# Altium schematic sheet ovencontrol.SchDoc
size A3; PageSetup: Record=PageOptions|CenterHorizontal=True|CenterVertical=True|PrintScale=1.00|XCorrection=1.00|YCorrection=1.00|PrintKind=1|BorderSize=5000000|LeftOffset=0|BottomOffset=0|Orientation=2|PaperLength=1000|PaperWidth=1000|Scale=100|PaperSource=7|PrintQuality=-4|MediaType=1|DitherType=10|PaperKind=A3|PrintScaleMode=1
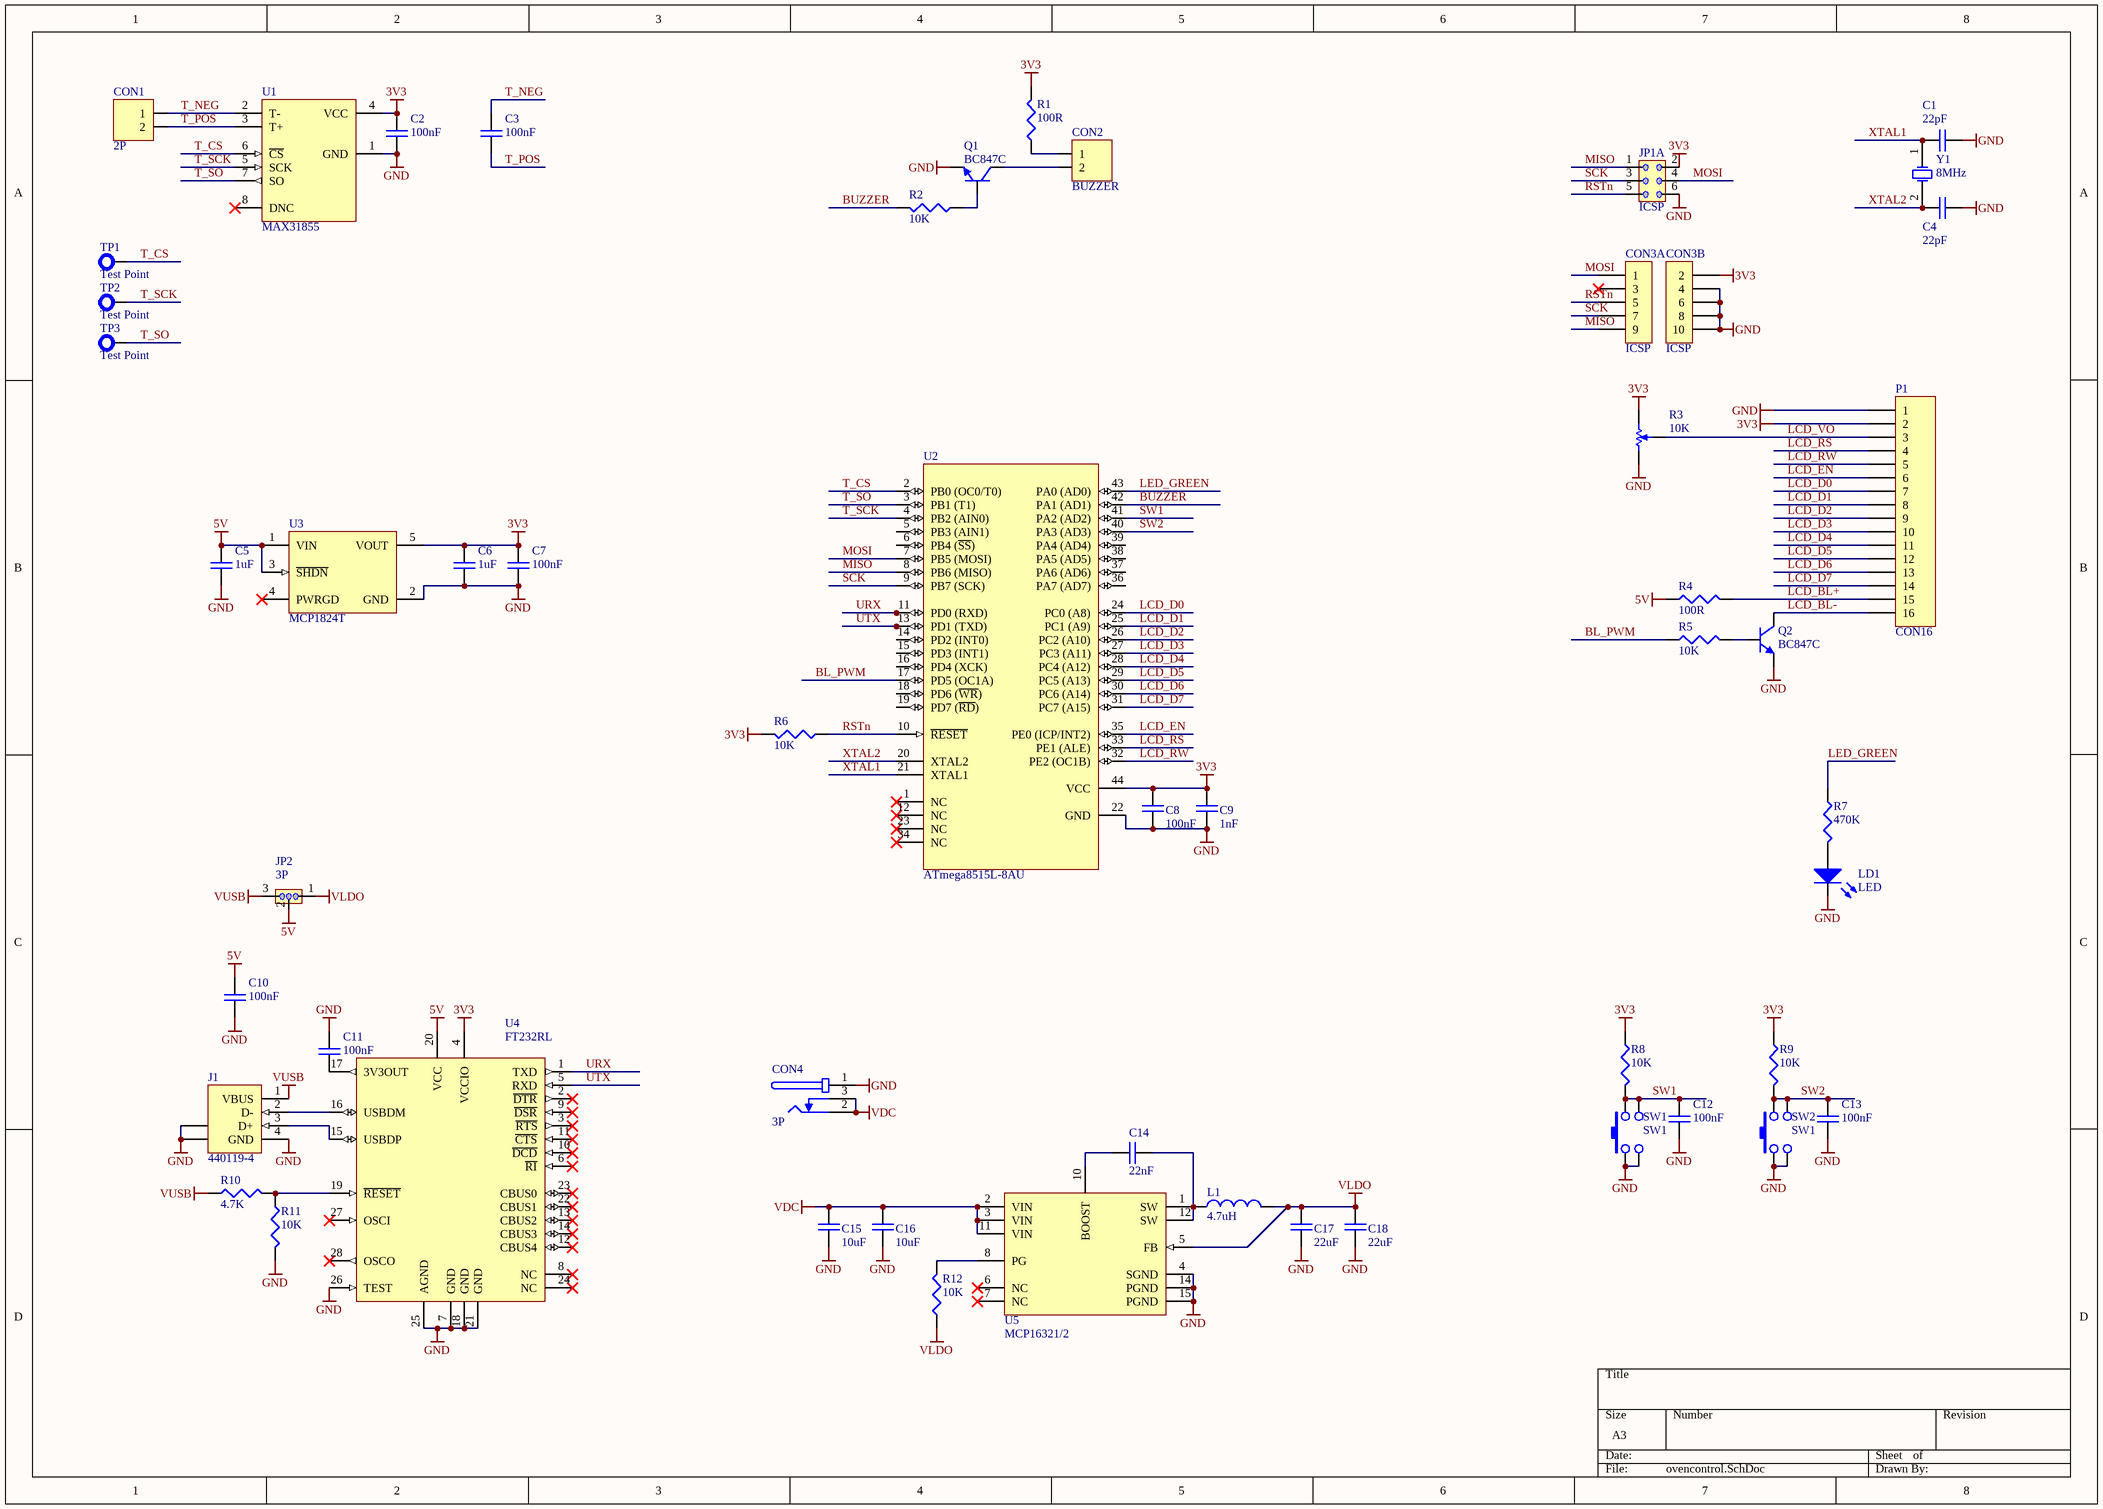
[diagram p0: ovencontrol.SchDoc]

## Parts
C1  22pF  [0603]
C2  100nF  [0603]
C3  100nF  [0603]
C4  22pF  [0603]
C5  1uF  [0603]
C6  1uF  [0603]
C7  100nF  [0603]
C8  100nF  [0603]
C9  1nF  [0603]
C10  100nF  [0603]
C11  100nF  [0603]
C12  100nF  [0603]
C13  100nF  [0603]
C14  22nF  [0603]
C15  10uF  [0603]
C16  10uF  [0603]
C17  22uF  [0603]
C18  22uF  [0603]
CON1  2P  [INTERLOCK2-5MM]
CON2  BUZZER  [SIP-2]
CON3  ICSP  [IDC-10-F]  (parts A,B of 2)
CON4  3P  [JACKPOW/PD-2.5MM-TH]
J1  440119-4  [440119]
JP1  ICSP  [DIL-6]  (part A of 3)
JP2  3P  [SIP-3]
L1  4.7uH  [6X6]
LD1  LED  [0805@DIODE]
P1  CON16  [HDR1X16]
Q1  BC847C  [SOT-23@BEC]
Q2  BC847C  [SOT-23@BEC]
R1  100R  [0603]
R2  10K  [0603]
R3  10K  [POT4MM-2]
R4  100R  [0603]
R5  10K  [0603]
R6  10K  [0603]
R7  470K  [0603]
R8  10K  [0603]
R9  10K  [0603]
R10  4.7K  [0603]
R11  10K  [0603]
R12  10K  [0603]
SW1  SW1  [MICROSWITCH]
SW2  SW1  [MICROSWITCH]
TP1  Test Point  [TERMINAL]  (no BOM)
TP2  Test Point  [TERMINAL]  (no BOM)
TP3  Test Point  [TERMINAL]  (no BOM)
U1  MAX31855  [SOIC-8]
U2  ATmega8515L-8AU  [TQFP-44]
U3  MCP1824T  [SOT-23-5]
U4  FT232RL  [SSOP-28]
U5  MCP16321/2  [QFN50P300X300-16V4L]
Y1  8MHz  [HC-49U]

## Nets
3V3: C2.1 C6.1 C7.1 C8.2 C9.2 CON3.2 JP1.2 P1.2 R1.2 R3.CW(+) R6.1 R8.1 R9.1 U1.4(VCC) U2.44(VCC) U3.5(VOUT) U4.4(VCCIO)
5V: C5.1 C10.1 JP2.2 R4.1 U3.1(VIN) U3.3(~{SHDN}) U4.20(VCC)
GND: C1.1 C2.2 C4.1 C5.2 C6.2 C7.2 C8.1 C9.1 C10.2 C11.1 C12.2 C13.2 C15.2 C16.2 C17.2 C18.2 CON3.4 CON3.6 CON3.8 CON3.10 CON4.1 J1.4(GND) J1.5(SHLD) J1.6(SHLD) JP1.6 LD1.K P1.1 Q1.E Q2.E R3.CCW(-) R11.2 SW1.1 SW1.3 SW2.1 SW2.3 U1.1(GND) U2.22(GND) U3.2(GND) U4.7(GND) U4.18(GND) U4.21(GND) U4.25(AGND) U4.26(TEST) U5.4(SGND) U5.14(PGND) U5.15(PGND)
VDC: C15.1 C16.1 CON4.2 CON4.3 U5.2(VIN) U5.3(VIN) U5.11(VIN)
VLDO: C17.1 C18.1 JP2.1 L1.2 R12.2 U5.5(FB)
VUSB: J1.1(VBUS) JP2.3 R10.1
BL_PWM: R5.1 U2.17(PD5_(OC1A))
BUZZER: R2.2 U2.42(PA1_(AD1))
LCD_BL+: P1.15 R4.2
LCD_BL-: P1.16 Q2.C
LCD_D0: P1.7 U2.24(PC0_(A8))
LCD_D1: P1.8 U2.25(PC1_(A9))
LCD_D2: P1.9 U2.26(PC2_(A10))
LCD_D3: P1.10 U2.27(PC3_(A11))
LCD_D4: P1.11 U2.28(PC4_(A12))
LCD_D5: P1.12 U2.29(PC5_(A13))
LCD_D6: P1.13 U2.30(PC6_(A14))
LCD_D7: P1.14 U2.31(PC7_(A15))
LCD_EN: P1.6 U2.35(PE0_(ICP/INT2))
LCD_RS: P1.4 U2.33(PE1_(ALE))
LCD_RW: P1.5 U2.32(PE2_(OC1B))
LCD_VO: P1.3 R3.W
LED_GREEN: R7.1 U2.43(PA0_(AD0))
MISO: CON3.9 JP1.1 U2.8(PB6_(MISO))
MOSI: CON3.1 JP1.4 U2.7(PB5_(MOSI))
RSTn: CON3.5 JP1.5 R6.2 U2.10(~{RESET})
SCK: CON3.7 JP1.3 U2.9(PB7_(SCK))
SW1: C12.1 R8.2 SW1.2 SW1.4 U2.41(PA2_(AD2))
SW2: C13.1 R9.2 SW2.2 SW2.4 U2.40(PA3_(AD3))
T_CS: TP1.1(TP) U1.6(~{CS}) U2.2(PB0_(OC0/T0))
T_NEG: C3.1 CON1.1 U1.2(T-)
T_POS: C3.2 CON1.2 U1.3(T+)
T_SCK: TP2.1(TP) U1.5(SCK) U2.4(PB2_(AIN0))
T_SO: TP3.1(TP) U1.7(SO) U2.3(PB1_(T1))
URX: U2.11(PD0_(RXD)) U4.1(TXD)
UTX: U2.13(PD1_(TXD)) U4.5(RXD)
XTAL1: C1.2 U2.21(XTAL1) Y1.1(OSC1)
XTAL2: C4.2 U2.20(XTAL2) Y1.2(OSC2)
NetC11_2: C11.2 U4.17(3V3OUT)
NetC14_1: C14.1 U5.10(BOOST)
NetC14_2: C14.2 L1.1 U5.1(SW) U5.12(SW)
NetCON2_1: CON2.1 R1.1
NetCON2_2: CON2.2 Q1.C
NetJ1_2: J1.2(D-) U4.16(USBDM)
NetJ1_3: J1.3(D+) U4.15(USBDP)
NetLD1_A: LD1.A R7.2
NetQ1_B: Q1.B R2.1
NetQ2_B: Q2.B R5.2
NetR10_2: R10.2 R11.1 U4.19(~{RESET})
NetR12_1: R12.1 U5.8(PG)

Not connected (* = marked no-connect by the designer): CON3 3*; U1 8(DNC)*; U2 1(NC)* 5(PB3_(AIN1)) 6(PB4_(~{SS})) 12(NC)* 14(PD2_(INT0)) 15(PD3_(INT1)) 16(PD4_(XCK)) 18(PD6_(~{WR})) 19(PD7_(~{RD})) 23(NC)* 34(NC)* 36(PA7_(AD7)) 37(PA6_(AD6)) 38(PA5_(AD5)) 39(PA4_(AD4)); U3 4(PWRGD)*; U4 2(~{DTR})* 3(~{RTS})* 6(~{RI})* 8(NC)* 9(~{DSR})* 10(~{DCD})* 11(~{CTS})* 12(CBUS4)* 13(CBUS2)* 14(CBUS3)* 22(CBUS1)* 23(CBUS0)* 24(NC)* 27(OSCI)* 28(OSCO)*; U5 6(NC)* 7(NC)*

## Library data of the parts
C1-C18 = CAP: Capacitor; Owner: Nuno Brum; Sub-Type: Ceramic; Assembly: INS; Maximum Voltage: *; Creation Date: 2005-04-28; Status: Valid; Validation date: 2006-05-15; Type: Capacitor
CON1 CON2 = CON02: Connector 2 pins; Owner: Rui Rebelo; Assembly: INS; Sub-Type: Connector; Creation Date: 2005-05-27; Status: Valid; Validation Date: 2006-05-15; Type: Electrical & Mechanical
CON3 = CON10: Connector 10 Pins; Owner: António Silva; Assembly: INS; Sub-Type: Connector; Creation Date: 2005-11-21; Status: Valid; Validation Date: 2006-05-15; Type: Electrical & Mechanical
CON4 = JACK POWER PD: Jack Power with insertion detect; Sub-Type: Connector; Owner: Gonçalo Costa; Assembly: INS; Creation Date: 2005-12-05; Status: New; Type: Electrical & Mechanical
J1 = 440119-4: USB 1.1, Right Angle, Thru-Hole, B Type, Receptacle, 4 Position, Black; ContactMaterial: Copper Alloy; ContactPlating: Gold (5) over Nickel; TerminationLength: 2.84mm [0.112in.]; PCB_Layout: Complies with manufacturer's recommendation.; DrillSize: Corresponds to nominal value.; PanelGround: Without; Published: 15-Jul-2004; DatasheetDocument: 12-Jan-2004; PackageDocument: 12-Jan-2004; PackageReference: 440119; Publisher: Altium Limited; HousingMaterial: Thermoplastic; ComponentLink1Description: Manufacturer Link; ComponentLink1URL: http://www.tycoelectronics.com/; ComponentLink2Description: Packaging Specification; ComponentLink2URL: http://ecommas.tycoelectronics.com/commerce/DocumentDelivery/DDEController?Action=showdoc&DocId=Customer+Drawing%7F440119%7FC%7Ftif%7FEnglish%7FC_440119_C.tif
JP1 = JMP6: 6-Pin Jumper; Sub-Type: Connector; Owner: Rui Rebelo; Assembly: INS; Creation Date: 2005-07-17; Status: Valid; Validation Date: 2006-05-15; Type: Electrical & Mechanical
JP2 = JMP3: 3-Jumper; Owner: Nuno Brum; Sub-Type: Connector; STATE1: 0; Assembly: INS; Validation Date: 2006-05-15; Creation Date: 2002-07-17; Status: Valid; Type: Electrical & Mechanical
L1 = IND: Inductor; Owner: Nuno Brum; Sub-Type: Generic; Assembly: INS; Validation date: 2006-05-15; Creation Date: 2002-07-17; Status: Valid; Type: Inductor
LD1 = LED: Light emitting diode; Owner: Nuno Brum; Assembly: INS; Creation Date: 2001-06-05; Sub-Type: LED; Status: Valid; Validation date: 2006-05-15; Model: LED; Type: Diode
P1 = CON16: Header, 16-Pin; LatestRevisionDate: 17-Jul-2002; LatestRevisionNote: Re-released for DXP Platform.; Publisher: Altium Limited
Q1 Q2 = NPN: NPN General Purpose Transistor; Owner: Nuno Brum; Sub-Type: Bipolar; Assembly: INS; Validation date: 2006-05-15; Creation Date: 2001-06-05; Status: Valid; Model: BC847C; Type: Transistor
R1 R2 R4-R12 = RES: Resistor; Owner: Nuno Brum; Sub-Type: Generic; Assembly: INS; Validation date: 2006-05-15; Creation Date: 2002-07-17; Status: Valid; Power: *; Type: Resistor
R3 = RES Pot: Square Trimming Potentiometer; Published: 17-Dec-2003; DatasheetVersion: Oct-2003; PackageReference: POT4MM-2; Publisher: Altium Limited; PackageDescription: Square Trimming Potentiometer; ComponentLink1Description: Manufacturer Link; ComponentLink1URL: http://bourns.com/2/search.html
SW1 SW2 = SW1: Switch Push Button; Owner: Nuno Brum; Assembly: INS; Validation Date: 2006-05-15; Sub-Type: Switch; Creation Date: 2002-07-17; Status: Valid; Type: Electrical & Mechanical
TP1-TP3 = TEST-PROBE: Test/Probe Point; Owner: Nuno Brum; Sub-Type: Mechanical; Assembly: PCB; Validation Date: 2006-05-15; Type: PCB; Creation Date: 2005-06-01; Status: Valid
U1 = MAX31855: Cold-Junction Compensated Thermocouple-to-Digital Converter
U2 = ATmega8515L-8AU: 8-bit AVR Microcontroller, 8KB Flash, 512 Bytes EEPROM, 512 Bytes SRAM, 2.7-5.5V, 44-pin TQFP, Industrial Grade (-40°C to 85°C); Published: 1-Apr-2010; DatasheetVersion: revK, Jan-2010; PackageVersion: rev.B, Oct-2001; PackageReference: 44A; Publisher: Altium Limited; PackageDescription: 44-Pin Plastic Thin Profile Quad Flat Pack, 10 x 10 x 1.0 mm Body, 0.8 mm Pitch (TQFP); Supplier 1: Digi-Key; Supplier Part Number 1: ATMEGA8515L-8AU-ND; Supplier 2: Farnell; Supplier Part Number 2: 9171410; Supplier 3: Farnell; Supplier Part Number 3: 1528435; Supplier 4: Mouser; Supplier Part Number 4: 556-ATMEGA8515L-8AU; ComponentLink1Description: Manufacturer Link; ComponentLink1URL: http://www.atmel.com/products/avr/default.asp?; ComponentLink2Description: ATmega8515(L) Datasheet; ComponentLink2URL: http://www.atmel.com/dyn/resources/prod_documents/doc2512.pdf; ComponentLink3Description: ATmega8515(L) Summary; ComponentLink3URL: http://www.atmel.com/dyn/resources/prod_documents/2512S.pdf; ComponentLink4Description: Atmel.com Home; ComponentLink4URL: http://www.atmel.com
U3 = MCP1824T: 300 mA, Low Voltage, Low Quiescent Current LDO Regulator, 5-Pin SOT-23, Extended Temperature, Tape and Reel; Published: 29-Jan-2009; DatasheetVersion: revA, Aug-2007; PackageVersion: revBB, Aug-2009; PackageReference: SOT-23-OT5; Publisher: Altium Limited; PackageDescription: 5-Lead Plastic Small Outline Transistor (OT) [SOT-23]; Supplier 1: Digi-Key; Supplier Part Number 1: MCP1824T-3302E/OTTR-ND; Supplier 2: Digi-Key; Supplier Part Number 2: MCP1824T-3302E/OTCT-ND; Supplier 3: Digi-Key; Supplier Part Number 3: MCP1824T-3302E/OTDKR-ND; Supplier 4: Farnell; Supplier Part Number 4: 1578387; Code_IPC: SOT23-5; ComponentLink1Description: Datasheet; ComponentLink1URL: http://ww1.microchip.com/downloads/en/DeviceDoc/22070a.pdf; ComponentLink2Description: Packaging Specification; ComponentLink2URL: http://www.microchip.com/stellent/groups/techpub_sg/documents/packagingspec/en012702.pdf; ComponentLink3Description: Microchip.com Home; ComponentLink3URL: http://www.microchip.com/
U4 = FT232RL: USB UART Asynchronous Serial Data Transfer Chip, SSOP-28, Tube; Published: 19-Aug-2010; DatasheetVersion: ver 2.07, Jul-2010; PackageVersion: 2010; PackageReference: SSOP-28; Publisher: Altium Limited; PackageDescription: 28-Pin Small Outline Package 0.65 mm Pitch; ComponentLink1Description: Manufacturer Link; ComponentLink1URL: http://www.ftdichip.com/Products/ICs/FT232R.htm; ComponentLink2Description: Datasheet; ComponentLink2URL: http://www.ftdichip.com/Support/Documents/DataSheets/ICs/DS_FT232R.pdf
U5 = MCP16321/2: 24V Input, 1A/2A Output, High Efficiency Synchronous Buck Regulator  with Power Good Indicatio
Y1 = Crystal Oscillator: Published: 17-Jul-2002; DatasheetDocument: 18-Apr-2000; PackageReference: CSM-7; Publisher: Altium Limited; ComponentLink1Description: Manufacturer Link; ComponentLink1URL: http://www.ecsxtal.com/; ComponentLink2Description: Datasheet; ComponentLink2URL: http://www.ecsxtal.com/pdf3/CSM_7.pdf